# EAGLE design main (EAGLE 9.4.2)
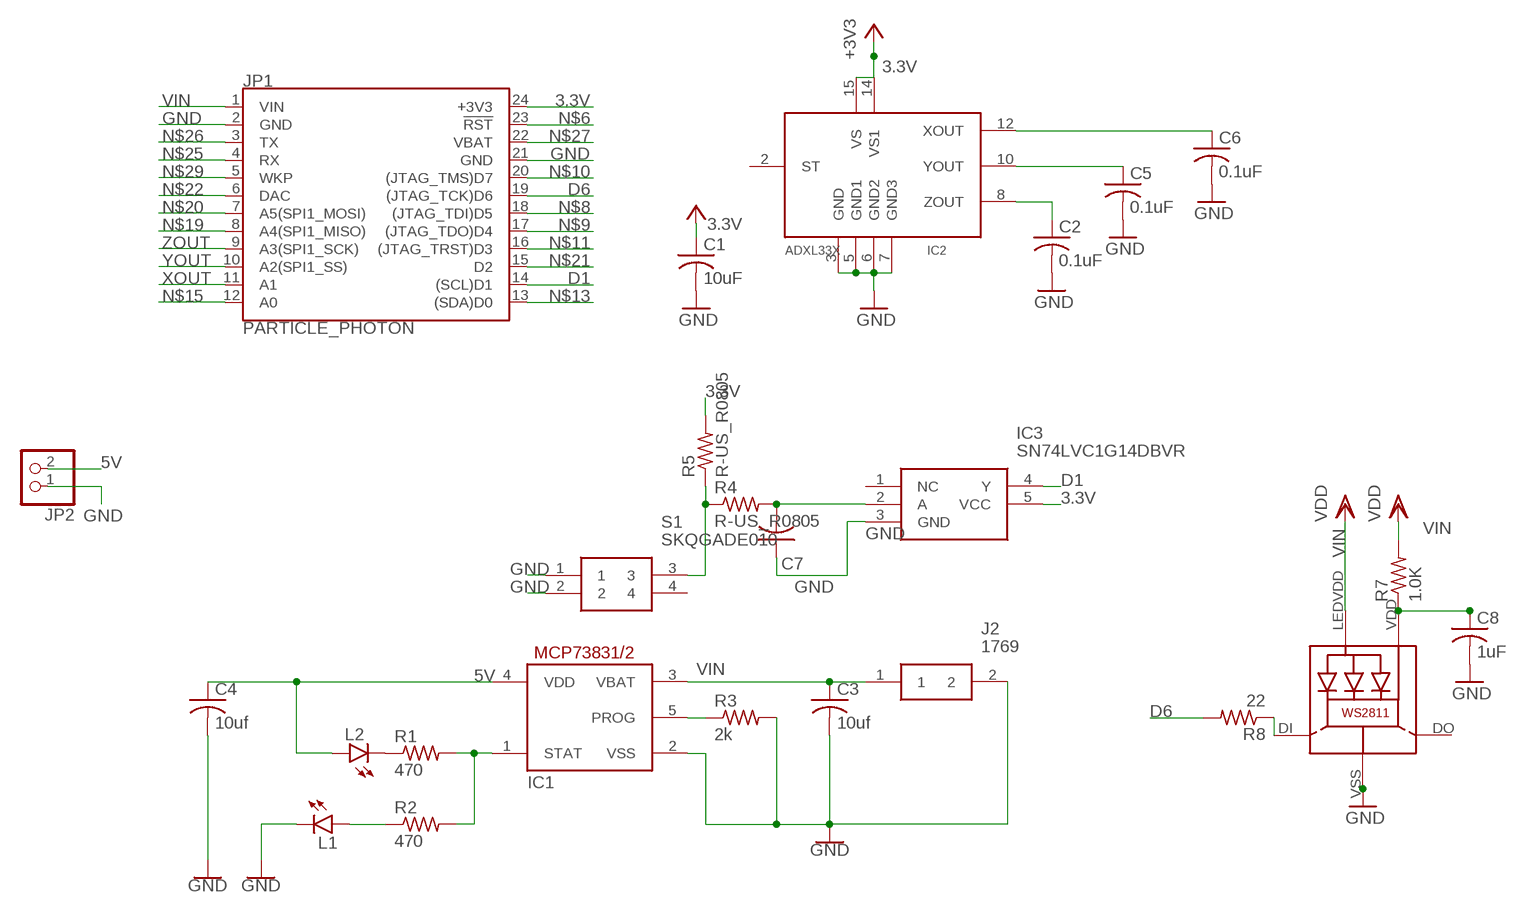
[diagram p0: schematic, sheet 1]

## Parts
C1  10uF  ADAFRUIT_C-USC0805K  [ADAFRUIT_C0805K]
C2  0.1uF  ADAFRUIT_C-USC0805K  [ADAFRUIT_C0805K]
C3  10uf  ADAFRUIT_C-USC0805K  [ADAFRUIT_C0805K]
C4  10uf  ADAFRUIT_C-USC0805K  [ADAFRUIT_C0805K]
C5  0.1uF  ADAFRUIT_C-USC0805K  [ADAFRUIT_C0805K]
C6  0.1uF  ADAFRUIT_C-USC0805K  [ADAFRUIT_C0805K]
C7  ADAFRUIT_C-USC0805K  [ADAFRUIT_C0805K]
C8  1uF  ADAFRUIT_C-USC0805K  [ADAFRUIT_C0805K]
IC1  MCP73831/OT  [SOT23-5L]
IC2  ADXL33X  [16LCSP]
IC3  SN74LVC1G14DBVR  [SOT95P280X145-5N]
J2  1769  [1769]
JP1  PARTICLE_PHOTON  [PARTICLE_PHOTON]
JP2  PINHD-1X2  [1X02]
L1  green  LED-FKIT-1206  [FKIT-LED-1206]
L2  blue  LED-FKIT-1206  [FKIT-LED-1206]
LED1  WS28115050  [WS28115050]
R1  470  R-US_R0805  [R0805]
R2  470  R-US_R0805  [R0805]
R3  2k  R-US_R0805  [R0805]
R4  R-US_R0805  [R0805]
R5  R-US_R0805  [R0805]
R7  1.0K  R-US_R0805  [R0805]
R8  22  R-US_R0805  [R0805]
S1  SKQGADE010  [SKQGAKE010]

## Nets
3.3V: C1.1 IC2.14(VS1) IC2.15(VS) IC3.5(VCC) JP1.24(+3V3) R5.2 ; supply symbol labelled +3V3
5V: C4.1 IC1.4(VDD) JP2.2 L2.A
D1: IC3.4(Y) JP1.14((SCL)D1)
D6: JP1.19((JTAG_TCK)D6) R8.2
GND: C1.2 C2.2 C3.2 C4.2 C5.2 C6.2 C7.1 C8.2 IC1.2(VSS) IC2.3(GND) IC2.5(GND1) IC2.6(GND2) IC2.7(GND3) IC3.3(GND) J2.2 JP1.2(GND) JP1.21(GND) JP2.1 L1.C LED1.VSS(GND) R3.2 S1.1 S1.2
IN: C7.2 IC3.2(A) R4.2
N$1: IC1.1(STAT) R1.2 R2.2
N$2: L2.C R1.1
N$3: L1.A R2.1
N$4: IC1.5(PROG) R3.1
N$5: R4.1 R5.1 S1.3
N$6: JP1.23(!RST!)
N$7: C8.1 LED1.VDD R7.1
N$8: JP1.18((JTAG_TDI)D5)
N$9: JP1.17((JTAG_TDO)D4)
N$10: JP1.20((JTAG_TMS)D7)
N$11: JP1.16((JTAG_TRST)D3)
N$13: JP1.13((SDA)D0)
N$14: LED1.DI R8.1
N$15: JP1.12(A0)
N$19: JP1.8(A4(SPI1_MISO))
N$20: JP1.7(A5(SPI1_MOSI))
N$21: JP1.15(D2)
N$22: JP1.6(DAC)
N$25: JP1.4(RX)
N$26: JP1.3(TX)
N$27: JP1.22(VBAT)
N$29: JP1.5(WKP)
VIN: C3.1 IC1.3(VBAT) J2.1 JP1.1(VIN) LED1.LEDVDD R7.2 ; supply symbol labelled VDD
XOUT: C6.1 IC2.12(XOUT) JP1.11(A1)
YOUT: C5.1 IC2.10(YOUT) JP1.10(A2(SPI1_SS))
ZOUT: C2.1 IC2.8(ZOUT) JP1.9(A3(SPI1_SCK))
Unconnected: IC2.2(ST) IC3.1(NC) LED1.DO S1.4

## Library data of the parts
C1-C8 = Adafruit ADXL335.rpt:ADAFRUIT_C-US: CAPACITOR, American symbol
IC1 = miguel:MCP73831: MCP73831/2 Miniature Single-Cell, Fully Integrated Li-Ion, Li-Polymer Charge Management Controllers. Nice and small simple lipoly charge controller, with adjustable current and status output (LED) http://www.ladyada.net/library/pcb/eaglelibrary.html
IC2 = adafruit:ADXL33X
IC3 = SamacSys_Parts:SN74LVC1G14DBVR: TEXAS INSTRUMENTS - SN74LVC1G14DBVR - IC, SCHMITT TRIGGER INVERTER, SMD Source: Datasheet <http://www.farnell.com/datasheets/1965693.pdf>; DESCRIPTION: TEXAS INSTRUMENTS - SN74LVC1G14DBVR - IC, SCHMITT TRIGGER INVERTER, SMD; HEIGHT: 1.45mm; MANUFACTURER_NAME: Texas Instruments; MANUFACTURER_PART_NUMBER: SN74LVC1G14DBVR; MOUSER_PART_NUMBER: 595-SN74LVC1G14DBVR; MOUSER_PRICE-STOCK: https://www.mouser.com/Search/Refine.aspx?Keyword=595-SN74LVC1G14DBVR
J2 = SamacSys_Parts:1769: Adafruit Accessories JST-PH 2-pin SMT Right Angle Connect Source: Datasheet <https://cdn-shop.adafruit.com/datasheets/17311.pdf>; ALLIED_NUMBER: 70927965; ALLIED_PRICE-STOCK: https://www.alliedelec.com/adafruit-industries-1769/70927965/; DESCRIPTION: Adafruit Accessories JST-PH 2-pin SMT Right Angle Connect; HEIGHT: mm; MANUFACTURER_NAME: Adafruit; MANUFACTURER_PART_NUMBER: 1769; MOUSER_PART_NUMBER: 485-1769; MOUSER_PRICE-STOCK: https://www.mouser.com/Search/Refine.aspx?Keyword=485-1769
JP1 = SparkFun-Boards2:PARTICLE_PHOTON: Particle Photon Footprint of the Particle Photon that is used as a basis for many Photon shields. SparkFun Products: Particle Photon <https://www.sparkfun.com/products/13764> SparkFun Photon ProtoShield <https://www.sparkfun.com/products/13598> SparkFun Photon micro OLED Shield <https://www.sparkfun.com/products/13628> SparkFun Photon IMU Shield <https://www.sparkfun.com/products/13629> SparkFun Photon Battery Shield <https://www.sparkfun.com/products/13626>
JP2 = DC_LOAD_AU:PINHD-1X2: PIN HEADER
L1 L2 = SparkFun-LED:LED: LED (Generic) Standard schematic elements and footprints for 5mm, 3mm, 1206, and 0603 sized LEDs. Generic LEDs with no color specified.
LED1 = microbuilder:WS28115050
R1-R5 R7 R8 = audio amplifier example:R-US_: RESISTOR, American symbol
S1 = SamacSys_Parts:SKQGADE010: Tact switch,SMT,SPST,with stem,2.55N o/f Stem Tactile Switch, SPST-NO 50 mA 1.5mm Source: Datasheet <http://www.farnell.com/datasheets/1776657.pdf>; DESCRIPTION: Tact switch,SMT,SPST,with stem,2.55N o/f Stem Tactile Switch, SPST-NO 50 mA 1.5mm; HEIGHT: mm; MANUFACTURER_NAME: ALPS; MANUFACTURER_PART_NUMBER: SKQGADE010; MOUSER_PART_NUMBER: 688-SKQGAD; MOUSER_PRICE-STOCK: https://www.mouser.com/Search/Refine.aspx?Keyword=688-SKQGAD; RS_PART_NUMBER: 7582067; RS_PRICE-STOCK: http://uk.rs-online.com/web/p/products/7582067

## Board
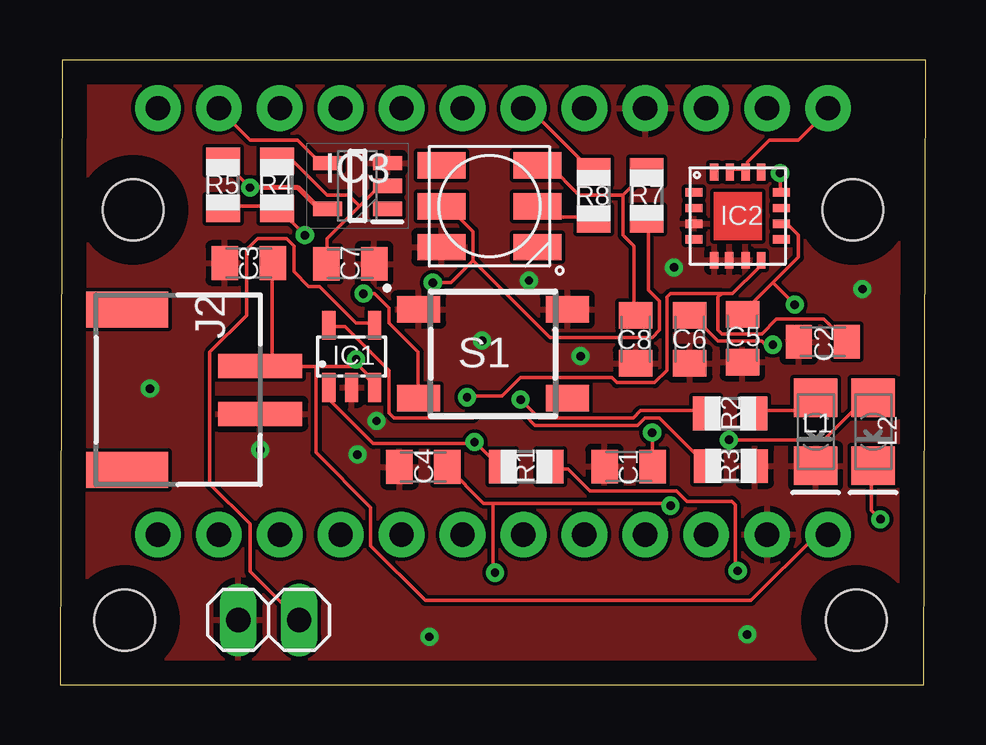
[diagram p1: board, top side]
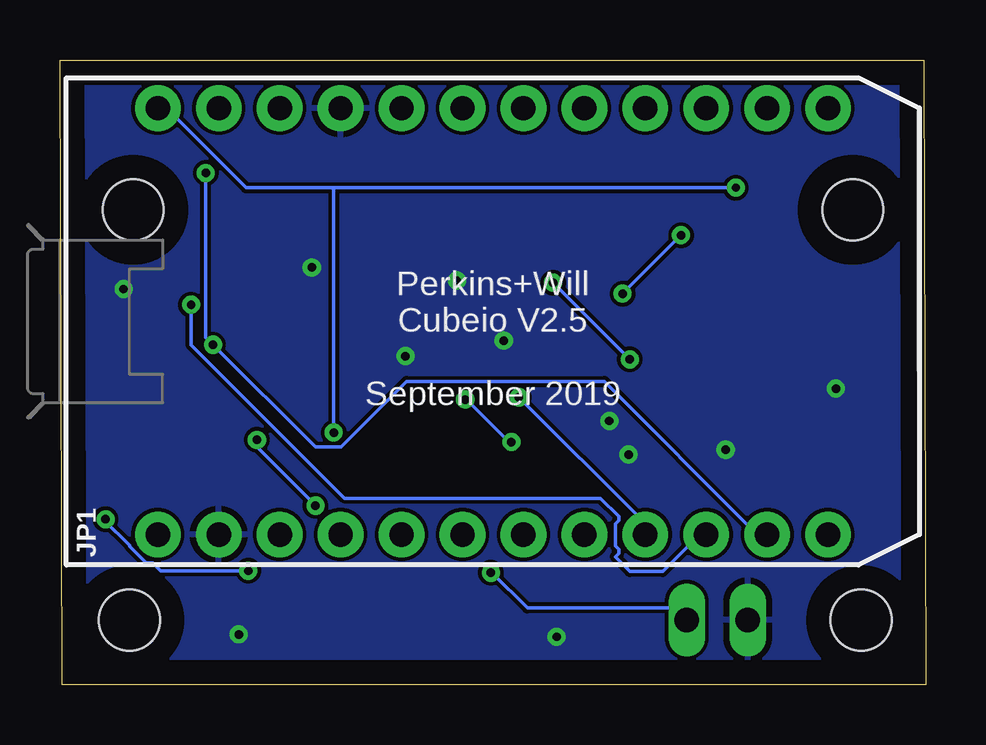
[diagram p2: board, bottom side, seen from below]

Size 36.1 x 26.05 mm. Coordinates in mm from the lower left corner, seen from the top.
Outline: 0,0 36,0 36.1,26.05 0.1,26.05 0,0
Copper layers (1*16): Top 0.035mm / dielectric 1.5mm / Bottom 0.035mm
Design rules "default": minimum track width 6mil, minimum drill 0.35mm, track to track 6mil, track to pad 6mil, pad to pad 6mil, via to via 6mil, smd to smd 6mil, copper to edge 40mil, drill to drill 6mil, minimum pad ring 10mil, minimum via ring 8mil, stop-mask expansion 4mil, vias tented up to drill 0mil, thermal gap 10mil
Holes 2.54 mm at 33.05,19.8 2.7,2.7 33.2,2.7 3.05,19.8

### Footprints (pad centres in the part's own frame; a part is rotated, then mirrored left to right if it is on the bottom)
ADAFRUIT_C0805K = smd 1.1 x 1.4: 1 -1,0; 2 1,0
SOT23-5L = smd 0.55 x 1.2: 1 -0.95,-1.3; 2 0,-1.3; 3 0.95,-1.3; 4 0.95,1.3; 5 -0.95,1.3
16LCSP = smd 0.7 x 0.35: 1 -1.825,0.975; 2 -1.825,0.325; 3 -1.825,-0.325; 4 -1.825,-0.975; 9 1.825,-0.975; 10 1.825,-0.325; 11 1.825,0.325; 12 1.825,0.975 | smd 0.35 x 0.7: 5 -0.975,-1.85; 6 -0.35,-1.85; 7 0.325,-1.85; 8 0.975,-1.85; 13 0.975,1.825; 14 0.325,1.825; 15 -0.325,1.825; 16 -0.975,1.825
SOT95P280X145-5N = smd 1.2 x 0.6: 1 -1.25,0.95; 2 -1.25,0; 3 -1.25,-0.95; 4 1.25,-0.95; 5 1.25,0.95
1769 = smd 1 x 3.5: 1 -1,0; 2 1,0 | smd 1.5 x 3.4: 3 -3.35,-5.55; 4 3.35,-5.55
PARTICLE_PHOTON = drill 1.016 pad 1.905: 1 -8.89,13.97; 2 -8.89,11.43; 3 -8.89,8.89; 4 -8.89,6.35; 5 -8.89,3.81; 6 -8.89,1.27; 7 -8.89,-1.27; 8 -8.89,-3.81; 9 -8.89,-6.35; 10 -8.89,-8.89; 11 -8.89,-11.43; 12 -8.89,-13.97; 13 8.89,-13.97; 14 8.89,-11.43; 15 8.89,-8.89; 16 8.89,-6.35; 17 8.89,-3.81; 18 8.89,-1.27; 19 8.89,1.27; 20 8.89,3.81; 21 8.89,6.35; 22 8.89,8.89; 23 8.89,11.43; 24 8.89,13.97
1X02 = drill 1.016 long: 1 -1.27,0; 2 1.27,0
FKIT-LED-1206 = smd 1.6 x 1.803: A -1.422,0; C 1.422,0
WS28115050 = smd 2 x 1.1: DI 2,0; DO 2,-1.7; LEDVDD -2,0; NC -2,1.7; VDD 2,1.7; VSS -2,-1.7
R0805 = smd 1.1 x 1.4: 1 -1,0; 2 1,0
SKQGAKE010 = smd 1.8 x 1.1: 1 -3.1,1.85; 2 3.1,1.85; 3 -3.1,-1.85; 4 3.1,-1.85

### Placement (x,y rotation side)
C1  23.7,9.1 180 top
C2  31.8,14.3 180 top
C3  7.87,17.58 180 top
C4  15.15,9.08 180 top
C5  28.45,14.45 270 top
C6  26.25,14.4 270 top
C7  12.1,17.55 180 top
C8  24,14.4 270 top
IC1  12.16,13.69 0 top
IC2  28.25,19.55 0 top
IC3  12.4,20.8 180 top
J2  8.35,12.3 270 top
JP1  18.05,15.15 90 bottom
JP2  8.7,2.7 0 top
L1  31.5,10.55 270 top
L2  33.9,10.55 270 top
LED1  17.9,19.95 0 top
R1  19.44,9.1 180 top
R2  27.94,11.31 180 top
R3  27.97,9.12 0 top
R4  9.05,20.85 90 top
R5  6.8,20.85 90 top
R7  24.45,20.4 270 top
R8  22.25,20.4 90 top
S1  18.05,13.8 0 top

### Tracks (layer width: path | path; a pad name or v marks a point on that pad's centre or on a via)
3.3V  (via drill 0.35)
  Top 0.152: IC2.15 28.04,21.49 28.5,21.49 IC2.14 28.65,21.49 28.65,21.79 29.57,22.71 30.79,22.71 32,23.93 JP1.24 | v7.92,20.73 6.86,21.79 R5.2 | v24.69,10.52 24.69,9.14 C1.1
  Top 0.203: IC3.5 10.8,19.85 9.92,20.73 v7.92,20.73
  Bottom 0.152: 24.69,20.73 28.35,20.73 31.55,23.93 32,23.93 JP1.24 | 24.69,20.73 v7.92,20.73 | 24.69,20.73 v24.69,10.52
5V  (via drill 0.35)
  Top 0.152: IC1.4 13.11,15.09 12.34,15.09 10.82,16.61 10.36,16.61 9.75,17.22 9.75,18.29 9.45,18.59 8.23,18.59 7.77,18.14 7.77,15.39 6.25,13.87 6.25,8.38 7.92,6.71 7.92,4.72 9.91,2.74 JP2.2 | C4.1 17.66,7.57 18.05,7.57 | 18.05,7.57 18.05,4.67 v18.14,4.67 | v27.89,10.21 31.85,10.21 33.53,11.89 33.83,11.89 L2.A | 18.05,7.57 25.35,7.57 v25.45,7.47
  Bottom 0.152: v18.14,4.67 18.09,4.67 16.61,3.2 10.52,3.2 10.06,2.74 JP2.2 | v27.89,10.21 27.89,9.91 v25.45,7.47
D1
  Top 0.152: IC3.4 11.12,21.79 10.82,21.79 9.91,22.71 7.92,22.71 6.71,23.93 JP1.14
D6
  Top 0.152: R8.2 22.1,21.49 19.66,23.93 19.36,23.93 JP1.19
GND  (via drill 0.35)
  other vias: 21.7,13.7 17.6,14.35 28.65,2.1 15.4,2 12.4,9.6 3.75,12.35 19.55,16.85 25.6,17.4 13.2,11 8.35,9.8 33.45,16.5
  pour Top: 0.1,0 0.1,26 35.9,26 35.9,0.8 36.9,-0.2
  pour Bottom: 0.1,0.05 0.1,26 35.9,26 35.9,0.5 35.45,0.05
IN
  Top 0.152: 12.5,19.96 11.12,18.59 11.12,17.68 C7.2 | 12.5,19.96 13.26,20.73 13.56,20.73 IC3.2 | 12.5,19.96 12.04,20.42 11.12,20.42 9.75,21.79 9.14,21.79 R4.2
N$1  (via drill 0.35)
  Top 0.152: 17.37,10.06 13.06,10.06 11.28,11.84 11.28,12.34 IC1.1 | 17.37,10.06 17.47,9.96 18.29,9.14 R1.2 | v19.2,11.89 19.96,11.12 23.9,11.12 24.2,11.43 26.82,11.43 R2.2 | v17.28,10.12 17.31,10.12 17.37,10.06
  Bottom 0.152: v19.2,11.89 19.15,11.89 17.38,10.12 v17.28,10.12
N$2  (via drill 0.35)
  Top 0.152: R1.1 20.57,8.99 21.18,8.99 22.1,8.07 25.7,8.07 26.13,7.65 28,7.65 28.15,7.5 28.15,4.75 v28.25,4.75 | L2.C 33.83,8.99 33.83,7.27 v34.2,6.9
  Bottom 0.152: v28.25,4.75 31.91,4.75 32.24,5.08 32.51,5.08 33.2,5.77 33.2,5.8 34.25,6.85 v34.2,6.9
N$3
  Top 0.152: R2.1 28.96,11.43 30.94,11.43 31.39,11.89 L1.A
N$4
  Top 0.152: IC1.5 11.28,14.94 11.89,14.94 13.72,13.11 13.72,11.33 13.92,11.12 17.23,11.12 17.38,11.28 19.36,11.28 19.81,10.82 24.08,10.82 24.38,11.12 24.99,11.12 26.98,9.14 R3.1
N$5  (via drill 0.35)
  Top 0.152: R5.1 6.86,19.96 8.99,19.96 R4.1 9.14,19.81 v10.21,18.75 | v12.65,16.31 13.11,16.31 13.72,15.7 13.72,15.09 14.94,13.87 14.94,12.04 S1.3
  Bottom 0.152: v10.21,18.75 v12.65,16.31
N$7
  Top 0.152: 23.47,20.42 23.47,18.75 23.93,18.29 23.93,15.54 C8.1 | 23.47,20.42 24.38,21.34 R7.1 | 23.47,20.42 21.64,20.42 20.42,21.64 19.96,21.64 LED1.VDD
N$14
  Top 0.152: R8.1 22.1,19.51 20.27,19.51 19.96,19.81 LED1.DI
VIN  (via drill 0.35)
  Top 0.152: 17.22,17.68 20.42,14.48 24.69,14.48 24.99,14.78 24.99,16 24.54,16.46 24.54,19.36 R7.2 | 17.22,17.68 17.22,18.9 16.31,19.81 16,19.81 LED1.LEDVDD | 8.84,13.26 8.38,13.26 J2.1 8.84,13.26 | 8.84,13.26 10.67,13.26 | 10.67,13.26 12.34,13.26 | 12.34,13.26 12.5,13.26 12.8,12.95 12.8,12.8 13.11,12.5 IC1.3 | 8.84,13.26 8.84,17.53 C3.1 | 10.67,13.26 10.67,9.68 12.95,7.4 12.95,5.79 15.23,3.52 28.81,3.52 31.54,6.25 32,6.25 JP1.1 | 17.22,17.68 16.31,16.76 v15.54,16.76 | 12.34,13.26 v12.34,13.56
  Bottom 0.152: v12.34,13.56 v15.54,16.76
XOUT  (via drill 0.35)
  Top 0.152: v30.02,21.34 30.02,20.57 IC2.12 | v29.72,14.17 29.41,14.17 29.26,14.33 27.43,14.33 26.36,15.39 C6.1
  Bottom 0.152: v30.02,21.34 30.02,14.48 v29.72,14.17 25.45,9.91 24.38,9.91 21.64,12.65 13.41,12.65 7.16,6.4 6.71,6.4 JP1.11
YOUT  (via drill 0.35)
  Top 0.152: 29.72,16.76 28.5,15.54 C5.1 | 29.72,16.76 30.79,17.83 30.79,18.75 30.33,19.2 30.18,19.2 IC2.10 | v30.63,15.85 29.72,16.76
  Bottom 0.152: v30.63,15.85 30.63,14.17 24.23,7.77 13.56,7.77 12.8,7.01 12.8,6.86 12.95,6.71 12.95,5.79 12.8,5.64 12.8,5.49 12.95,5.33 12.34,4.72 10.97,4.72 9.3,6.4 JP1.10
ZOUT  (via drill 0.35)
  Top 0.152: 27.58,16.31 28.04,16.31 29.11,17.37 29.11,17.68 IC2.8 | 27.58,16.31 27.43,16.15 27.43,14.78 27.58,14.63 29.26,14.63 29.87,15.24 31.85,15.24 32.77,14.33 C2.1 | v16.97,11.98 16.97,12.04 18.44,12.04 19.2,12.8 23.01,12.8 23.22,12.6 24.79,12.6 25.3,13.11 25.3,16.15 25.45,16.31 27.58,16.31
  Bottom 0.152: v16.97,11.98 11.85,6.87 JP1.9

### Text on the board
bNames: Perkins+Will / Cubeio V2.5 / / September 2019